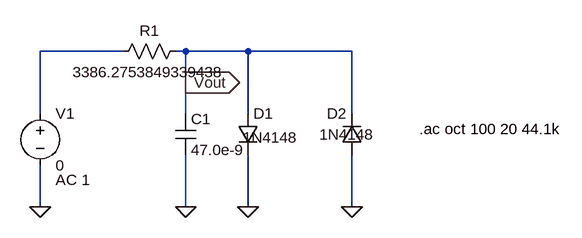
[diagram p0: schematic diode-clipper-frequency-analysis.asc]
diode-clipper-frequency-analysis.asc, the LTspice schematic file:
Version 4
SHEET 1 880 680
WIRE 160 224 32 224
WIRE 256 224 240 224
WIRE 352 224 256 224
WIRE 512 224 352 224
WIRE 256 272 256 224
WIRE 32 320 32 224
WIRE 256 320 256 272
WIRE 352 320 352 224
WIRE 512 320 512 224
WIRE 32 464 32 400
WIRE 256 464 256 384
WIRE 352 464 352 384
WIRE 512 464 512 384
FLAG 32 464 0
FLAG 352 464 0
FLAG 512 464 0
FLAG 256 464 0
FLAG 256 272 Vout
IOPIN 256 272 Out
SYMBOL voltage 32 304 R0
WINDOW 123 24 118 Left 2
SYMATTR Value2 AC 1
SYMATTR InstName V1
SYMATTR Value 0
SYMBOL diode 336 320 R0
WINDOW 3 8 37 Left 2
SYMATTR Value 1N4148
SYMATTR InstName D1
SYMBOL diode 528 384 R180
WINDOW 0 24 64 Left 2
WINDOW 3 -19 32 Left 2
SYMATTR InstName D2
SYMATTR Value 1N4148
SYMBOL res 256 208 R90
WINDOW 0 0 56 VBottom 2
WINDOW 3 32 56 VTop 2
SYMATTR InstName R1
SYMATTR Value 3386.2753849339438
SYMBOL cap 240 320 R0
SYMATTR InstName C1
SYMATTR Value 47.0e-9
TEXT 616 344 Left 2 !.ac oct 100 20 44.1k

The netlist it stands for:
* diode-clipper-frequency-analysis.asc
V1 N001 0 0 AC 1
D1 Vout 0 1N4148
D2 0 Vout 1N4148
R1 Vout N001 3386.2753849339438
C1 Vout 0 47.0e-9
.model D D
.lib standard.dio
.ac oct 100 20 44.1k
.backanno
.end